# EAGLE design rev3 (EAGLE 7.2.0)
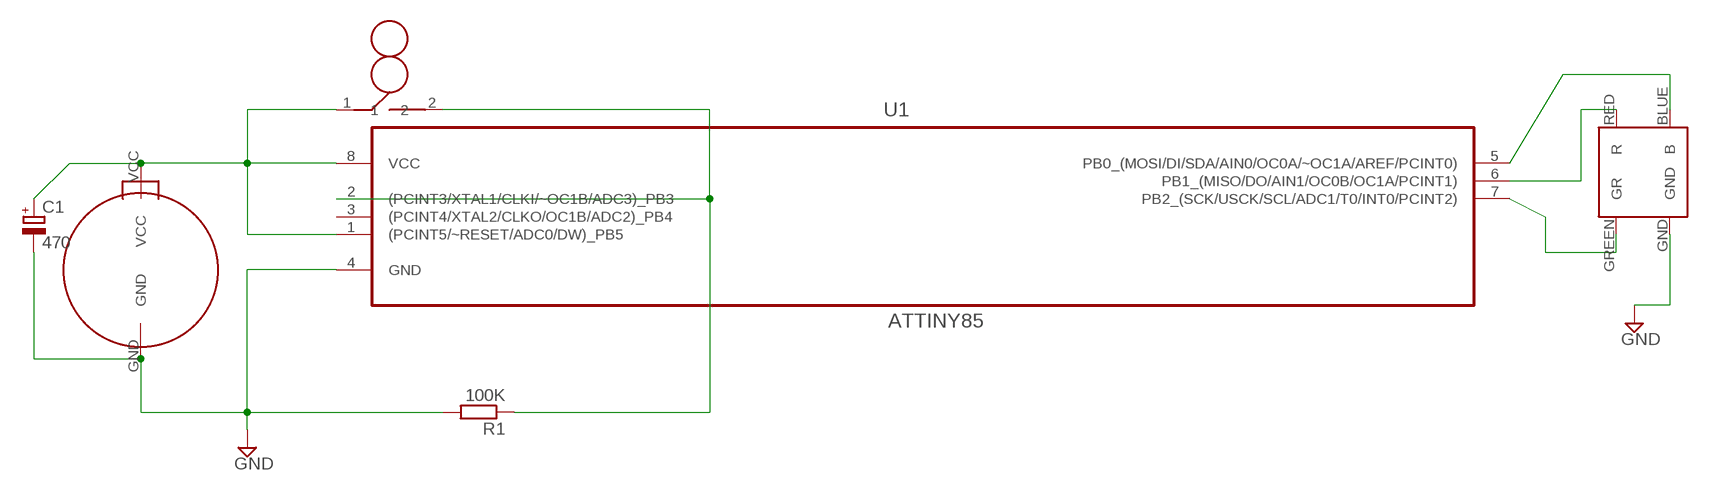
[diagram p0: schematic, sheet 1]

## Parts
C1  470  CPOL-EUE2.5-6  [E2,5-6]
R1  100K  R-EU_0207/10  [0207/10]
U1  ATTINY85  ATTINY85-20PU  [DIP254P762X533-8]
U$1  CR2032_2PIN  [CR2032_2PIN]
U$2  RGB_4PIN  [5MM_RGB]
U$3  BALL_SWITCH  [BALL_SW]

## Nets
BLUE: U1.7(PB2_(SCK/USCK/SCL/ADC1/T0/INT0/PCINT2)) U$2.GREEN(GR)
GND: C1.- R1.2 U1.4(GND) U$1.GND U$2.GND
GREEN: U1.6(PB1_(MISO/DO/AIN1/OC0B/OC1A/PCINT1)) U$2.RED(R)
PB3: R1.1 U1.2((PCINT3/XTAL1/CLKI/~OC1B/ADC3)_PB3) U$3.2
RED: U1.5(PB0_(MOSI/DI/SDA/AIN0/OC0A/~OC1A/AREF/PCINT0)) U$2.BLUE(B)
VCC: C1.+ U1.1((PCINT5/~RESET/ADC0/DW)_PB5) U1.8(VCC) U$1.VCC U$3.1
Unconnected: U1.3((PCINT4/XTAL2/CLKO/OC1B/ADC2)_PB4)

## Library data of the parts
C1 = rcl:CPOL-EU: POLARIZED CAPACITOR, European symbol
R1 = rcl:R-EU_: RESISTOR, European symbol
U1 = Atmel_By_element14_Batch_1-00:ATTINY85-20PU: 8-bit Microcontroller with In-System Programmable Flash; MPN: ATTINY85; OC_FARNELL: 1455162; OC_NEWARK: 58M3796; PACKAGE: PDIP-8; SUPPLIER: Atmel
U$1 = Ledpart:CR2032_2PIN
U$2 = Ledpart:RGB_4PIN
U$3 = Ledpart:BALL_SWITCH

## Board
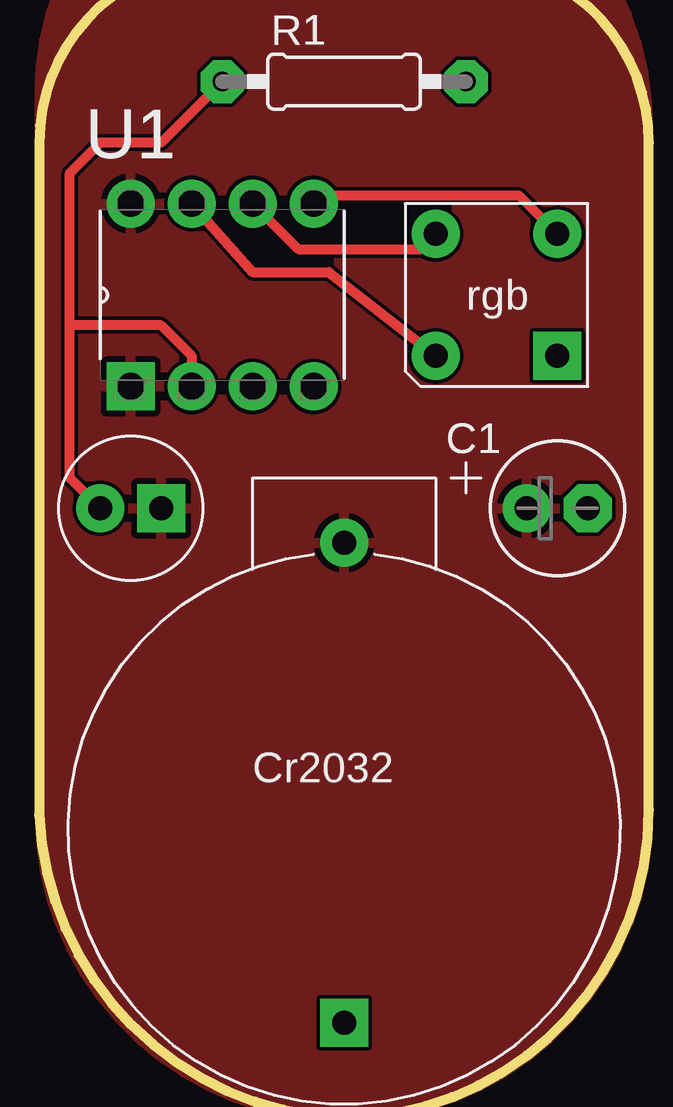
[diagram p1: board, top side]
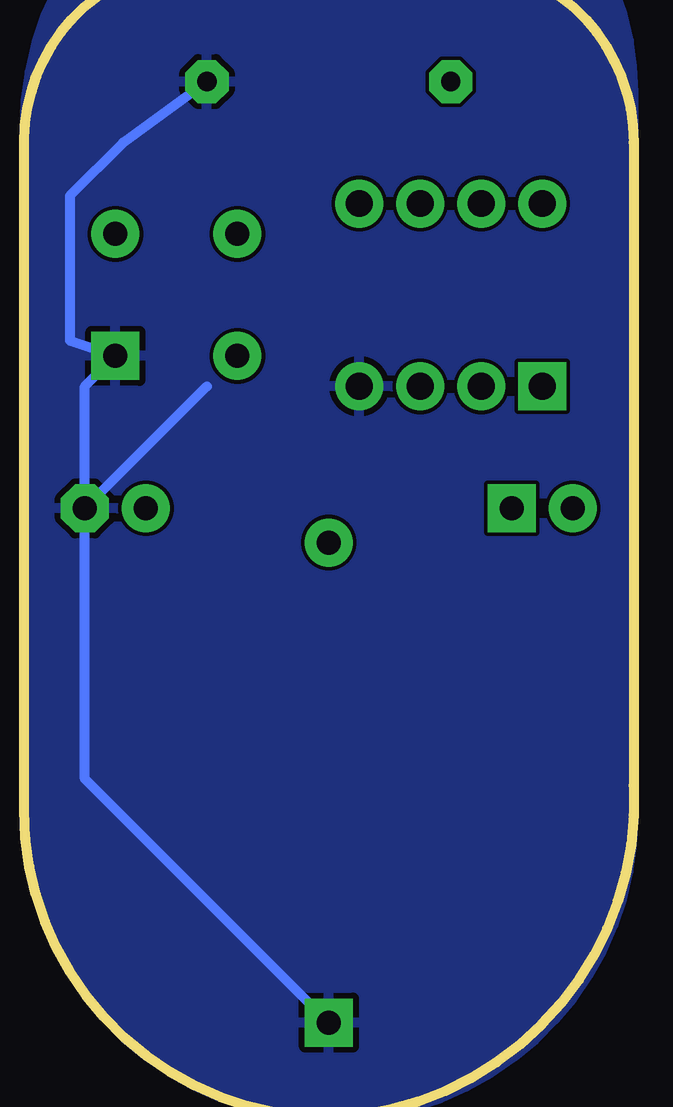
[diagram p2: board, bottom side, seen from below]

No outline drawn. Coordinates in mm, seen from the top.
Copper layers (1*16): Top 0.035mm / dielectric 1.5mm / Bottom 0.035mm
Design rules "Elecrow_2-layer_eagle_rule": minimum track width 6mil, minimum drill 12mil, track to track 6mil, track to pad 6mil, pad to pad 6mil, via to via 6mil, smd to smd 0mil, copper to edge 10mil, drill to drill 10mil, minimum pad ring 10mil, minimum via ring 6mil, stop-mask expansion 2mil, vias tented up to drill 100mil, thermal gap 10mil
Holes 3.2 mm at 13.97,48.26
Milling: 11 lines

### Footprints (pad centres in the part's own frame; a part is rotated, then mirrored left to right if it is on the bottom)
E2,5-6 = drill 1 pad 2: + -1.27,0 | drill 1 pad 2 octagon: - 1.27,0
0207/10 = drill 0.8 pad 1.8 octagon: 1 -5.08,0; 2 5.08,0
DIP254P762X533-8 = drill 1.118 pad 2 square: 1 -7.62,7.62 | drill 1.118 pad 2: 2 -7.62,5.08; 3 -7.62,2.54; 4 -7.62,0; 5 0,0; 6 0,2.54; 7 0,5.08; 8 0,7.62
CR2032_2PIN = drill 1 pad 2 square: GND 0,-10 | drill 1 pad 2: VCC 0,10
5MM_RGB = drill 1 pad 2: BLUE 2.54,2.54; GREEN -2.54,-2.54; RED -2.54,2.54 | drill 1 pad 2 square: GND 2.54,-2.54
BALL_SW = drill 1 pad 2 square: 1 -1.27,0 | drill 1 pad 2: 2 1.27,0

### Placement (x,y rotation side)
C1  22.86,24.13 0 top
R1  13.97,41.91 0 top
U1  12.7,36.83 90 top
U$1  13.97,12.7 0 top
U$2  20.32,33.02 0 top
U$3  5.08,24.13 180 top

### Tracks (layer width: path | path; a pad name or v marks a point on that pad's centre or on a via)
BLUE
  Top 0.406: U1.7 10.16,33.97 13.34,33.97 U$2.GREEN
GND
  Bottom 0.406: R1.2 22.54,39.37 24.77,37.15 24.77,31.11 U$2.GND 24.13,29.21 C1.- | U$1.GND 24.13,12.86 C1.- | C1.- 19.05,29.21
  pour Bottom: 1.27,11.3 1.27,41.44 arc-90 13.17,53.34 arc-90 26.67,39.84 26.67,11.56 arc-90 13.84,-1.27 arc-90
GREEN
  Top 0.406: U1.6 12.06,34.92 17.14,34.92 U$2.RED
PB3
  Top 0.406: R1.1 6.35,39.37 3.81,39.37 2.54,38.1 2.54,31.75 | U1.2 7.62,30.48 6.35,31.75 2.54,31.75 | U$3.2 2.54,25.4 2.54,31.75
RED
  Top 0.406: U$2.BLUE 21.27,37.15 13.34,37.15 13.02,36.83 U1.5
VCC
  pour Top: 26.67,11.43 26.67,39.84 arc90 13.17,53.34 arc90 1.27,41.44 1.27,11.43 arc90 13.97,-1.27 arc90

### Text on the board
_tNames: R1 | U1 | C1